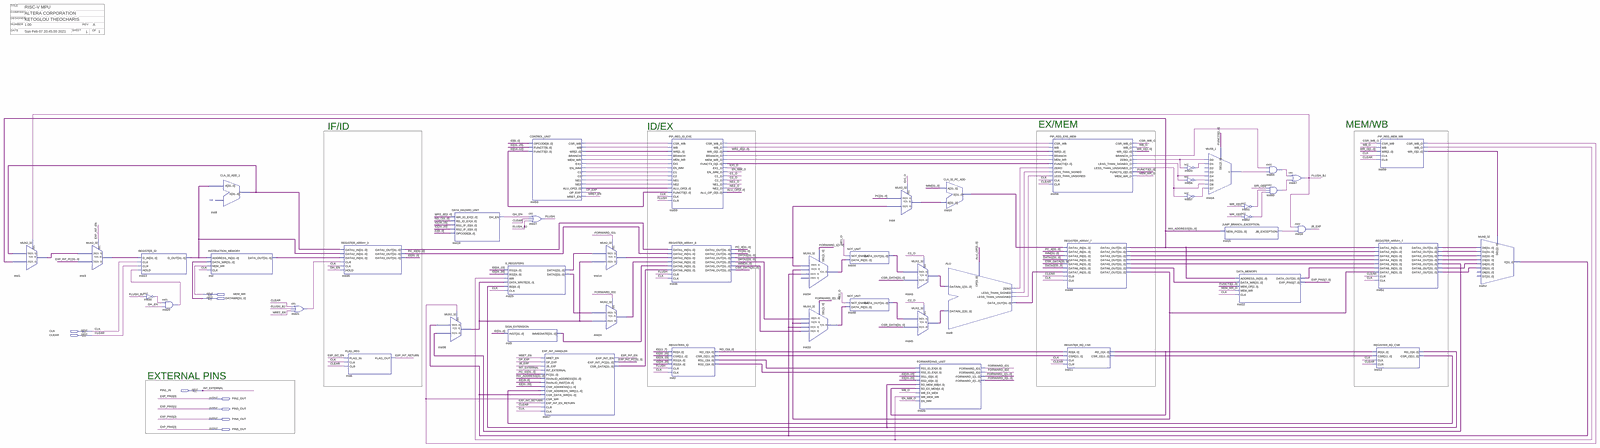
[diagram p0: schematic sheet, whole]
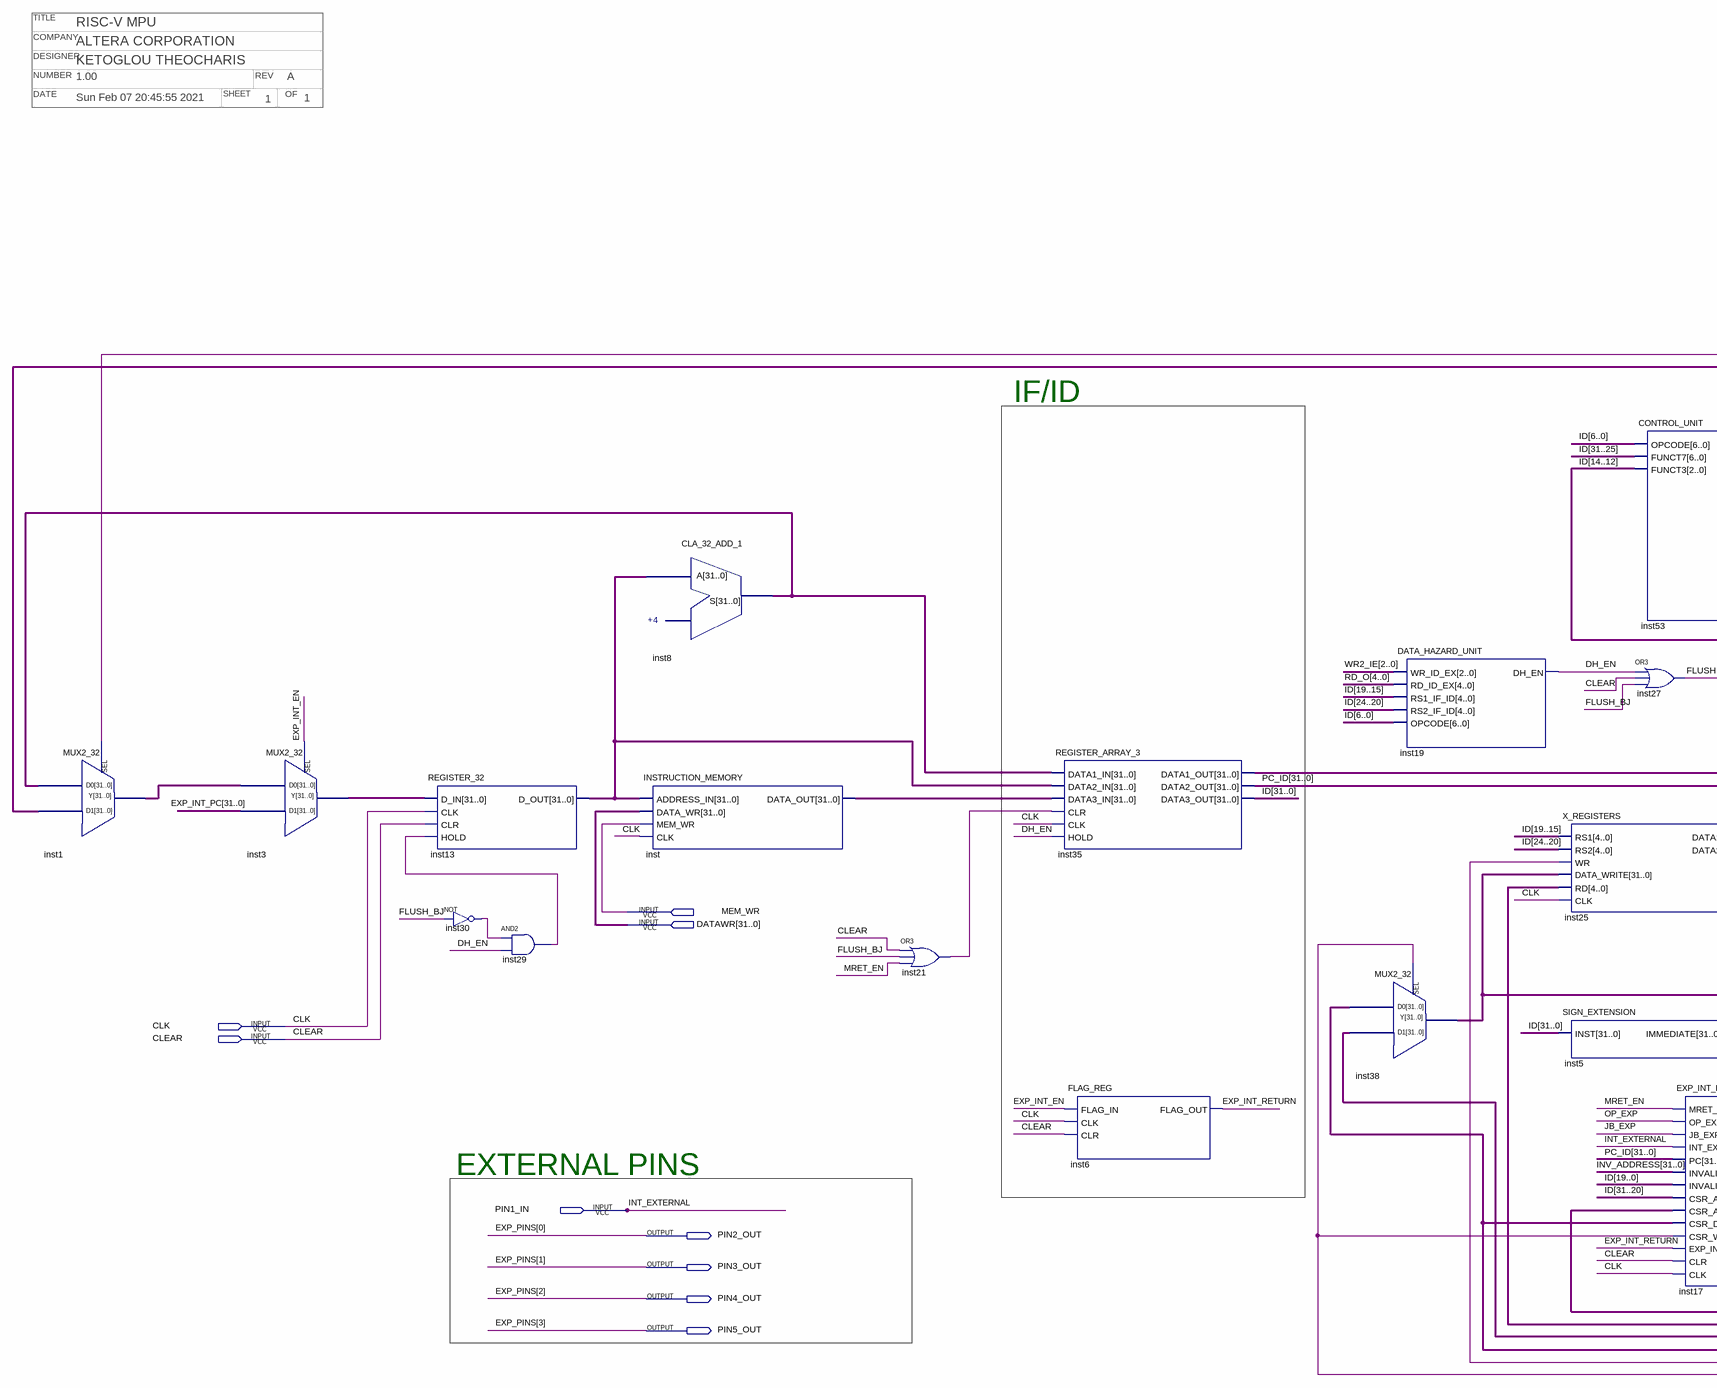
[diagram p1: schematic sheet, left part]
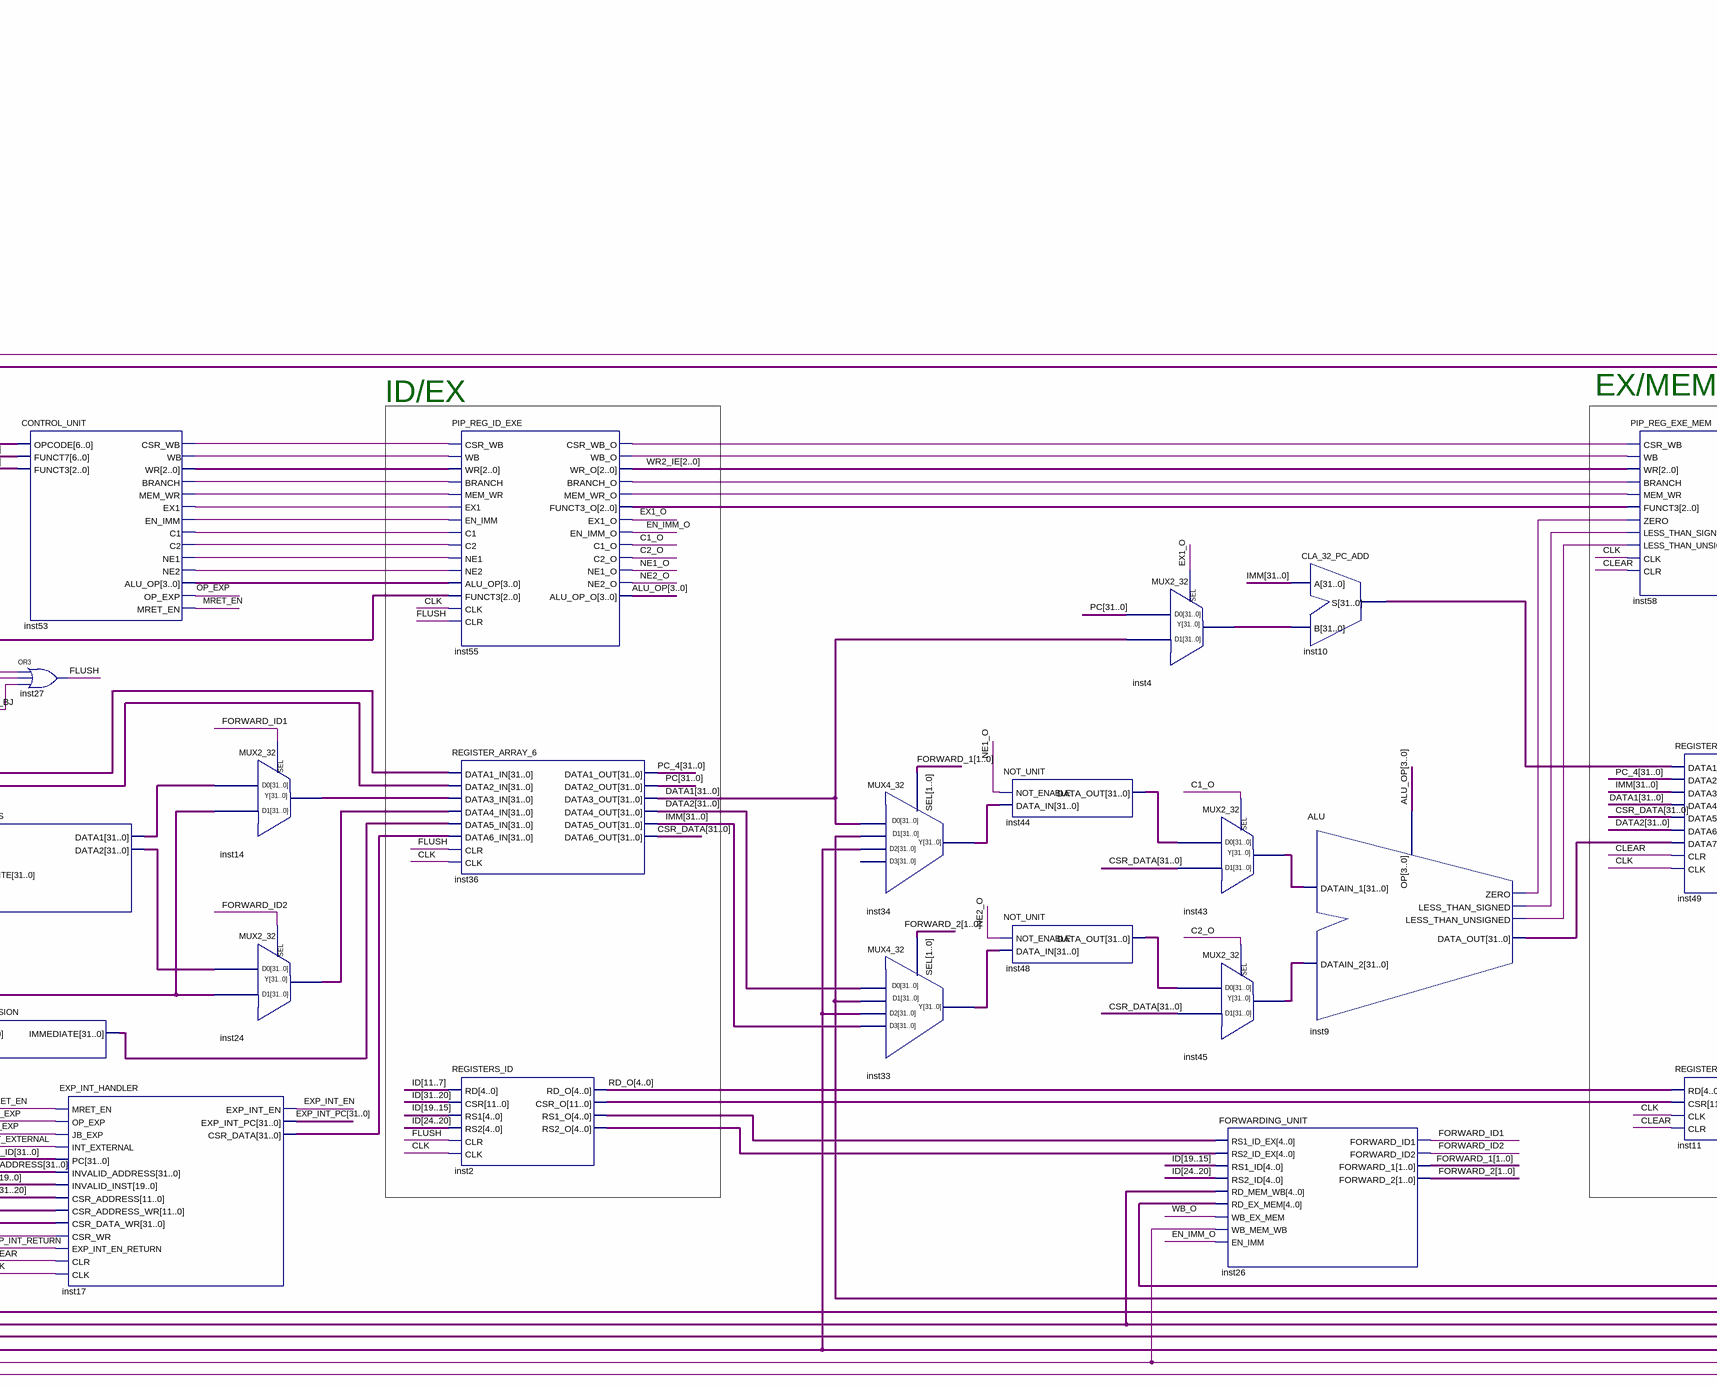
[diagram p2: schematic sheet, centre part]
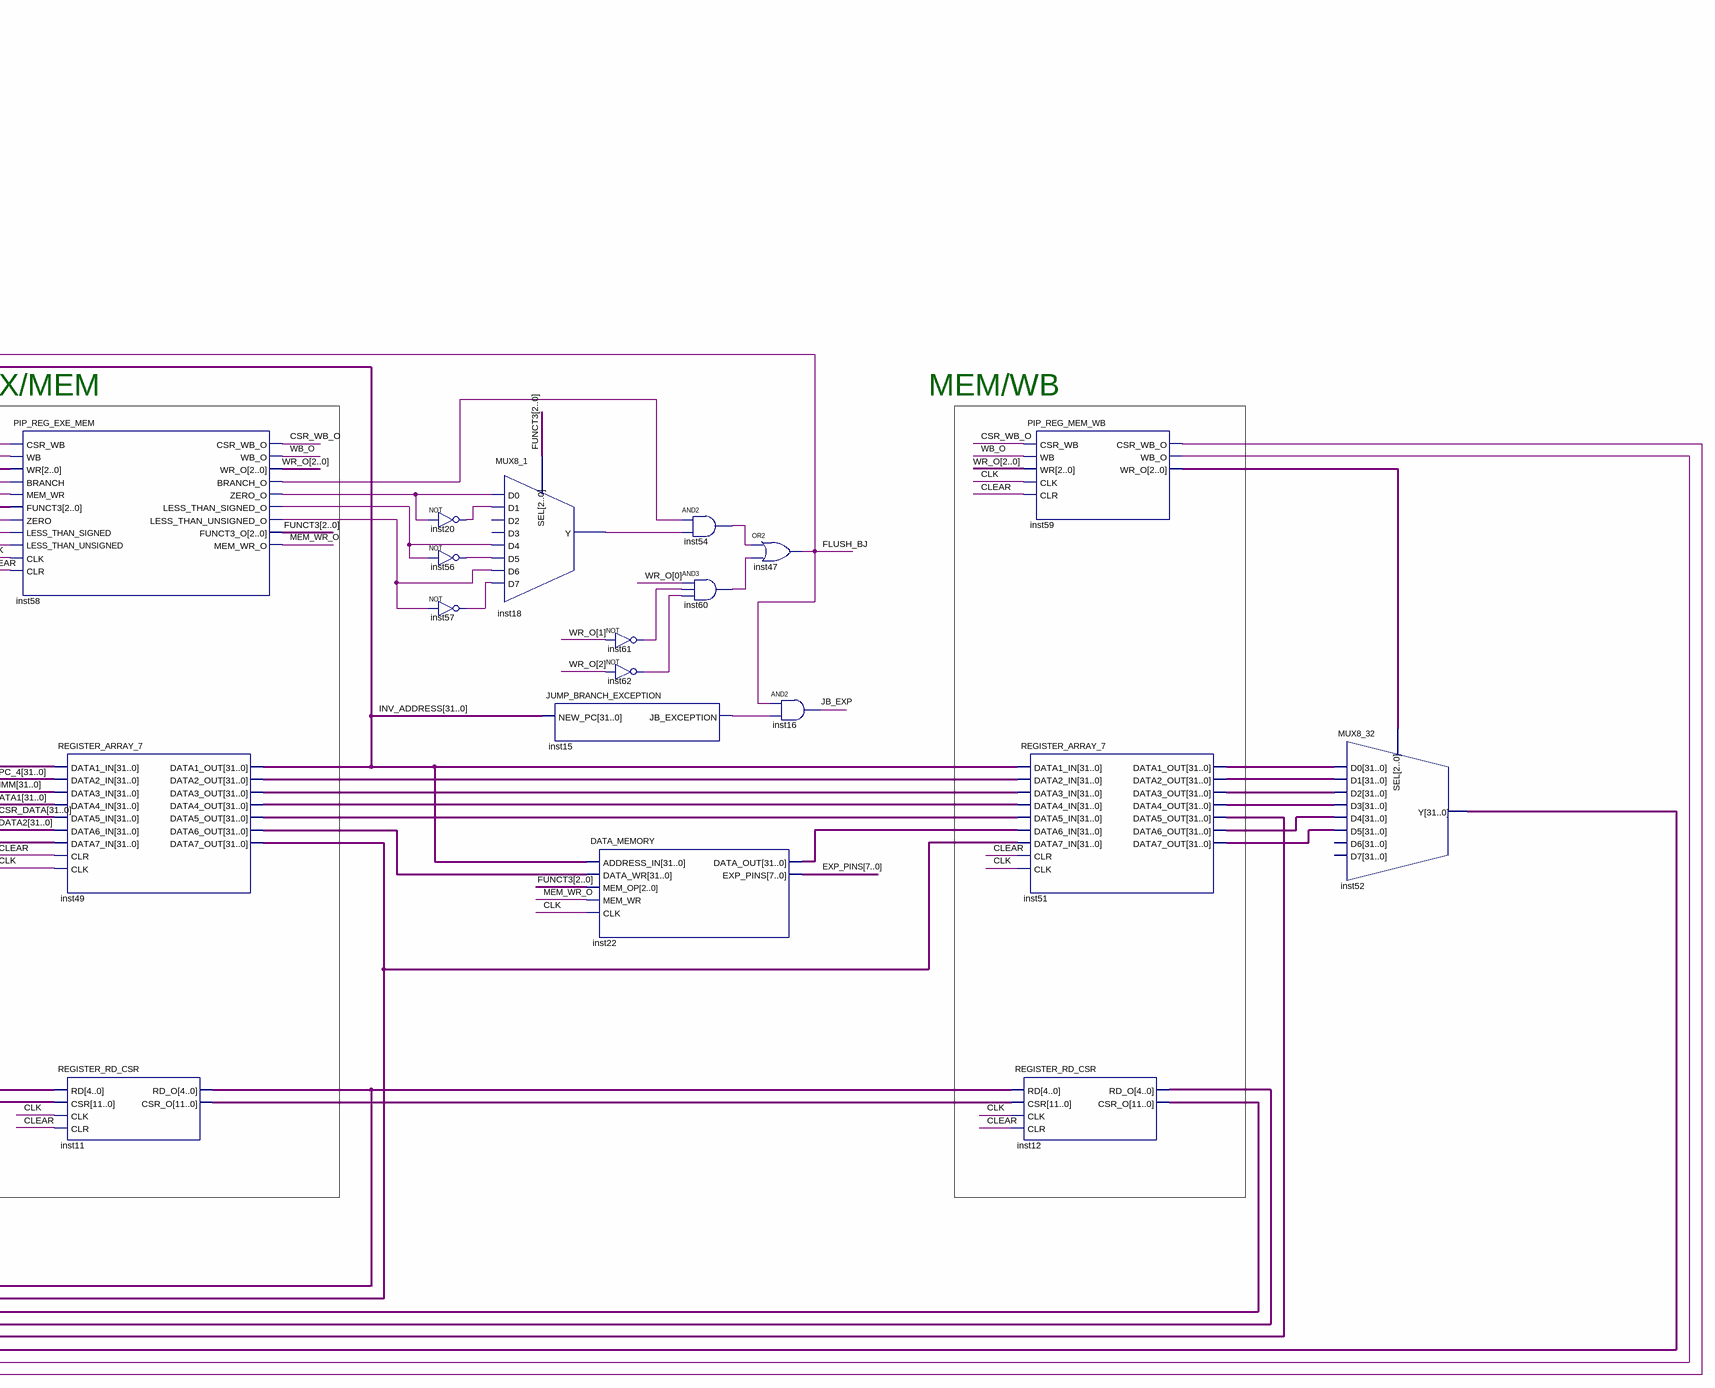
[diagram p3: schematic sheet, right part]
// Quartus schematic RISCV_CPU.bdf as structural Verilog: 51 symbols, 9 pins
// Title block: TITLE: RISC-V MPU; COMPANY: ALTERA CORPORATION; DESIGNER: KETOGLOU THEOCHARIS; NUMBER: 1.00; REV: A; DATE: Sun Feb 07 20:45:55 2021; SHEET: 1; OF: 1
module RISCV_CPU (
  input  MEM_WR,
  input  [31:0] DATAWR,
  input  CLK,
  input  CLEAR,
  input  PIN1_IN,
  output PIN2_OUT,
  output PIN3_OUT,
  output PIN4_OUT,
  output PIN5_OUT
);

  wire C1_O, C2_O, CSR_WB_O, DH_EN, EN_IMM_O, EX1_O, EXP_INT_EN, EXP_INT_RETURN, FLUSH, FLUSH_BJ,
       FORWARD_ID1, FORWARD_ID2, inst9_less_than_signed, inst9_less_than_unsigned, inst9_zero,
       inst15_jb_exception, inst18_y, inst20_out, inst21_out, inst29_out, inst30_out, inst53_branch,
       inst53_c1, inst53_c2, inst53_csr_wb, inst53_en_imm, inst53_ex1, inst53_mem_wr, inst53_ne1, inst53_ne2,
       inst53_wb, inst54_out, inst55_branch_o, inst55_csr_wb_o, inst55_mem_wr_o, inst55_wb_o, inst56_out,
       inst57_out, inst58_branch_o, inst58_less_than_signed_o, inst58_less_than_unsigned_o, inst58_zero_o,
       inst59_csr_wb_o, inst59_wb_o, inst60_out, inst61_out, inst62_out, JB_EXP, MEM_WR_O, MRET_EN, NE1_O,
       NE2_O, OP_EXP, WB_O;
  wire [1:0] FORWARD_1, FORWARD_2;
  wire [2:0] FUNCT3, inst53_wr, inst55_funct3_o, inst59_wr_o, WR2_IE, WR_O;
  wire [3:0] ALU_OP, inst53_alu_op;
  wire [4:0] inst2_rs1_o, inst2_rs2_o, inst11_rd_o, inst12_rd_o, RD_O;
  wire [7:4] EXP_PINS;
  wire [11:0] inst2_csr_o, inst11_csr_o, inst12_csr_o;
  wire [31:0] CSR_DATA, DATA1, DATA2, EXP_INT_PC, ID, IMM, inst1_y, inst3_y, inst4_y, inst5_immediate,
       inst8_s, inst9_data_out, inst10_s, inst13_d_out, inst14_y, inst17_csr_data, inst22_data_out, inst24_y,
       inst25_data1, inst25_data2, inst33_y, inst34_y, inst35_data1_out, inst38_y, inst43_y, inst44_data_out,
       inst45_y, inst48_data_out, inst49_data2_out, inst49_data3_out, inst49_data4_out, inst49_data5_out,
       inst49_data6_out, inst49_data7_out, inst51_data1_out, inst51_data2_out, inst51_data3_out,
       inst51_data4_out, inst51_data5_out, inst51_data6_out, inst51_data7_out, inst52_y, inst_data_out,
       INV_ADDRESS, PC, PC_4, PC_ID;

  MUX2_32 inst1 (.D1(INV_ADDRESS), .D0(inst8_s), .SEL(FLUSH_BJ), .Y(inst1_y));
  MUX2_32 inst3 (.D1(EXP_INT_PC), .D0(inst1_y), .SEL(EXP_INT_EN), .Y(inst3_y));
  REGISTER_32 inst13 (.D_IN(inst3_y), .CLK(CLK), .CLR(CLEAR), .HOLD(inst29_out), .D_OUT(inst13_d_out));
  not inst30 (inst30_out, FLUSH_BJ);
  and inst29 (inst29_out, inst30_out, DH_EN);
  CLA_32_ADD_1 inst8 (.A(inst13_d_out), .S(inst8_s));
  INSTRUCTION_MEMORY inst (
    .ADDRESS_IN(inst13_d_out), .DATA_WR(DATAWR), .MEM_WR(MEM_WR), .CLK(CLK), .DATA_OUT(inst_data_out));
  or inst21 (inst21_out, CLEAR, FLUSH_BJ, MRET_EN);
  REGISTER_ARRAY_3 inst35 (
    .DATA1_IN(inst8_s), .DATA2_IN(inst13_d_out), .DATA3_IN(inst_data_out), .CLR(inst21_out), .CLK(CLK),
    .HOLD(DH_EN), .DATA1_OUT(inst35_data1_out), .DATA2_OUT(PC_ID), .DATA3_OUT(ID));
  FLAG_REG inst6 (.FLAG_IN(EXP_INT_EN), .CLK(CLK), .CLR(CLEAR), .FLAG_OUT(EXP_INT_RETURN));
  DATA_HAZARD_UNIT inst19 (
    .WR_ID_EX(WR2_IE), .RD_ID_EX(RD_O), .RS1_IF_ID(ID[19:15]), .RS2_IF_ID(ID[24:20]), .OPCODE(ID[6:0]),
    .DH_EN(DH_EN));
  MUX2_32 inst38 (.D1(inst51_data5_out), .D0(inst52_y), .SEL(inst59_csr_wb_o), .Y(inst38_y));
  X_REGISTERS inst25 (
    .RS1(ID[19:15]), .RS2(ID[24:20]), .WR(inst59_wb_o), .DATA_WRITE(inst38_y), .RD(inst12_rd_o), .CLK(CLK),
    .DATA1(inst25_data1), .DATA2(inst25_data2));
  SIGN_EXTENSION inst5 (.INST(ID), .IMMEDIATE(inst5_immediate));
  CONTROL_UNIT inst53 (
    .OPCODE(ID[6:0]), .FUNCT7(ID[31:25]), .FUNCT3(ID[14:12]), .CSR_WB(inst53_csr_wb), .WB(inst53_wb),
    .WR(inst53_wr), .BRANCH(inst53_branch), .MEM_WR(inst53_mem_wr), .EX1(inst53_ex1), .EN_IMM(inst53_en_imm),
    .C1(inst53_c1), .C2(inst53_c2), .NE1(inst53_ne1), .NE2(inst53_ne2), .ALU_OP(inst53_alu_op),
    .OP_EXP(OP_EXP), .MRET_EN(MRET_EN));
  or inst27 (FLUSH, DH_EN, CLEAR, FLUSH_BJ);
  EXP_INT_HANDLER inst17 (
    .MRET_EN(MRET_EN), .OP_EXP(OP_EXP), .JB_EXP(JB_EXP), .INT_EXTERNAL(PIN1_IN), .PC(PC_ID),
    .INVALID_ADDRESS(INV_ADDRESS), .INVALID_INST(ID[19:0]), .CSR_ADDRESS(ID[31:20]),
    .CSR_ADDRESS_WR(inst12_csr_o), .CSR_DATA_WR(inst52_y), .CSR_WR(inst59_csr_wb_o),
    .EXP_INT_EN_RETURN(EXP_INT_RETURN), .CLR(CLEAR), .CLK(CLK), .EXP_INT_EN(EXP_INT_EN),
    .EXP_INT_PC(EXP_INT_PC), .CSR_DATA(inst17_csr_data));
  MUX2_32 inst14 (.D1(inst38_y), .D0(inst25_data1), .SEL(FORWARD_ID1), .Y(inst14_y));
  MUX2_32 inst24 (.D1(inst38_y), .D0(inst25_data2), .SEL(FORWARD_ID2), .Y(inst24_y));
  PIP_REG_ID_EXE inst55 (
    .CSR_WB(inst53_csr_wb), .WB(inst53_wb), .WR(inst53_wr), .BRANCH(inst53_branch), .MEM_WR(inst53_mem_wr),
    .EX1(inst53_ex1), .EN_IMM(inst53_en_imm), .C1(inst53_c1), .C2(inst53_c2), .NE1(inst53_ne1),
    .NE2(inst53_ne2), .ALU_OP(inst53_alu_op), .FUNCT3(ID[14:12]), .CLK(CLK), .CLR(FLUSH),
    .CSR_WB_O(inst55_csr_wb_o), .WB_O(inst55_wb_o), .WR_O(WR2_IE), .BRANCH_O(inst55_branch_o),
    .MEM_WR_O(inst55_mem_wr_o), .FUNCT3_O(inst55_funct3_o), .EX1_O(EX1_O), .EN_IMM_O(EN_IMM_O), .C1_O(C1_O),
    .C2_O(C2_O), .NE1_O(NE1_O), .NE2_O(NE2_O), .ALU_OP_O(ALU_OP));
  REGISTER_ARRAY_6 inst36 (
    .DATA1_IN(inst35_data1_out), .DATA2_IN(PC_ID), .DATA3_IN(inst14_y), .DATA4_IN(inst24_y),
    .DATA5_IN(inst5_immediate), .DATA6_IN(inst17_csr_data), .CLR(FLUSH), .CLK(CLK), .DATA1_OUT(PC_4),
    .DATA2_OUT(PC), .DATA3_OUT(DATA1), .DATA4_OUT(DATA2), .DATA5_OUT(IMM), .DATA6_OUT(CSR_DATA));
  REGISTERS_ID inst2 (
    .RD(ID[11:7]), .CSR(ID[31:20]), .RS1(ID[19:15]), .RS2(ID[24:20]), .CLR(FLUSH), .CLK(CLK), .RD_O(RD_O),
    .CSR_O(inst2_csr_o), .RS1_O(inst2_rs1_o), .RS2_O(inst2_rs2_o));
  MUX4_32 inst34 (.SEL(FORWARD_1), .D0(DATA1), .D2(inst52_y), .D1(inst49_data7_out), .Y(inst34_y));  // open: D3
  MUX4_32 inst33 (.SEL(FORWARD_2), .D0(DATA2), .D3(IMM), .D2(inst52_y), .D1(inst49_data7_out), .Y(inst33_y));
  NOT_UNIT inst44 (.NOT_ENABLE(NE1_O), .DATA_IN(inst34_y), .DATA_OUT(inst44_data_out));
  NOT_UNIT inst48 (.NOT_ENABLE(NE2_O), .DATA_IN(inst33_y), .DATA_OUT(inst48_data_out));
  MUX2_32 inst4 (.D1(DATA1), .D0(PC), .SEL(EX1_O), .Y(inst4_y));
  MUX2_32 inst43 (.D1(CSR_DATA), .D0(inst44_data_out), .SEL(C1_O), .Y(inst43_y));
  MUX2_32 inst45 (.D1(CSR_DATA), .D0(inst48_data_out), .SEL(C2_O), .Y(inst45_y));
  FORWARDING_UNIT inst26 (
    .RS1_ID_EX(inst2_rs1_o), .RS2_ID_EX(inst2_rs2_o), .RS1_ID(ID[19:15]), .RS2_ID(ID[24:20]),
    .RD_MEM_WB(inst12_rd_o), .RD_EX_MEM(inst11_rd_o), .WB_EX_MEM(WB_O), .WB_MEM_WB(inst59_wb_o),
    .EN_IMM(EN_IMM_O), .FORWARD_ID1(FORWARD_ID1), .FORWARD_ID2(FORWARD_ID2), .FORWARD_1(FORWARD_1),
    .FORWARD_2(FORWARD_2));
  CLA_32_PC_ADD inst10 (.A(IMM), .B(inst4_y), .S(inst10_s));
  ALU inst9 (
    .DATAIN_1(inst43_y), .DATAIN_2(inst45_y), .OP(ALU_OP), .DATA_OUT(inst9_data_out), .ZERO(inst9_zero),
    .LESS_THAN_SIGNED(inst9_less_than_signed), .LESS_THAN_UNSIGNED(inst9_less_than_unsigned));
  PIP_REG_EXE_MEM inst58 (
    .CSR_WB(inst55_csr_wb_o), .WB(inst55_wb_o), .WR(WR2_IE), .BRANCH(inst55_branch_o),
    .MEM_WR(inst55_mem_wr_o), .FUNCT3(inst55_funct3_o), .ZERO(inst9_zero),
    .LESS_THAN_SIGNED(inst9_less_than_signed), .LESS_THAN_UNSIGNED(inst9_less_than_unsigned), .CLK(CLK),
    .CLR(CLEAR), .CSR_WB_O(CSR_WB_O), .WB_O(WB_O), .WR_O(WR_O), .BRANCH_O(inst58_branch_o),
    .ZERO_O(inst58_zero_o), .LESS_THAN_SIGNED_O(inst58_less_than_signed_o),
    .LESS_THAN_UNSIGNED_O(inst58_less_than_unsigned_o), .FUNCT3_O(FUNCT3), .MEM_WR_O(MEM_WR_O));
  REGISTER_ARRAY_7 inst49 (
    .DATA1_IN(inst10_s), .DATA2_IN(PC_4), .DATA3_IN(IMM), .DATA4_IN(DATA1), .DATA5_IN(CSR_DATA),
    .DATA6_IN(DATA2), .DATA7_IN(inst9_data_out), .CLR(CLEAR), .CLK(CLK), .DATA1_OUT(INV_ADDRESS),
    .DATA2_OUT(inst49_data2_out), .DATA3_OUT(inst49_data3_out), .DATA4_OUT(inst49_data4_out),
    .DATA5_OUT(inst49_data5_out), .DATA6_OUT(inst49_data6_out), .DATA7_OUT(inst49_data7_out));
  REGISTER_RD_CSR inst11 (
    .RD(RD_O), .CSR(inst2_csr_o), .CLK(CLK), .CLR(CLEAR), .RD_O(inst11_rd_o), .CSR_O(inst11_csr_o));
  not inst20 (inst20_out, inst58_zero_o);
  not inst56 (inst56_out, inst58_less_than_signed_o);
  not inst57 (inst57_out, inst58_less_than_unsigned_o);
  MUX8_1 inst18 (
    .D0(inst58_zero_o), .D1(inst20_out), .D4(inst58_less_than_signed_o), .D5(inst56_out),
    .D6(inst58_less_than_unsigned_o), .D7(inst57_out), .SEL(FUNCT3), .Y(inst18_y));  // open: D2, D3
  JUMP_BRANCH_EXCEPTION inst15 (.NEW_PC(INV_ADDRESS), .JB_EXCEPTION(inst15_jb_exception));
  DATA_MEMORY inst22 (
    .ADDRESS_IN(INV_ADDRESS), .DATA_WR(inst49_data6_out), .MEM_OP(FUNCT3), .MEM_WR(MEM_WR_O), .CLK(CLK),
    .DATA_OUT(inst22_data_out), .EXP_PINS({EXP_PINS, PIN5_OUT, PIN4_OUT, PIN3_OUT, PIN2_OUT}));
  not inst61 (inst61_out, WR_O[1]);
  not inst62 (inst62_out, WR_O[2]);
  and inst54 (inst54_out, inst58_branch_o, inst18_y);
  and inst60 (inst60_out, WR_O[0], inst61_out, inst62_out);
  or inst47 (FLUSH_BJ, inst54_out, inst60_out);
  and inst16 (JB_EXP, FLUSH_BJ, inst15_jb_exception);
  PIP_REG_MEM_WB inst59 (
    .CSR_WB(CSR_WB_O), .WB(WB_O), .WR(WR_O), .CLK(CLK), .CLR(CLEAR), .CSR_WB_O(inst59_csr_wb_o),
    .WB_O(inst59_wb_o), .WR_O(inst59_wr_o));
  REGISTER_ARRAY_7 inst51 (
    .DATA1_IN(INV_ADDRESS), .DATA2_IN(inst49_data2_out), .DATA3_IN(inst49_data3_out),
    .DATA4_IN(inst49_data4_out), .DATA5_IN(inst49_data5_out), .DATA6_IN(inst22_data_out),
    .DATA7_IN(inst49_data7_out), .CLR(CLEAR), .CLK(CLK), .DATA1_OUT(inst51_data1_out),
    .DATA2_OUT(inst51_data2_out), .DATA3_OUT(inst51_data3_out), .DATA4_OUT(inst51_data4_out),
    .DATA5_OUT(inst51_data5_out), .DATA6_OUT(inst51_data6_out), .DATA7_OUT(inst51_data7_out));
  REGISTER_RD_CSR inst12 (
    .RD(inst11_rd_o), .CSR(inst11_csr_o), .CLK(CLK), .CLR(CLEAR), .RD_O(inst12_rd_o), .CSR_O(inst12_csr_o));
  MUX8_32 inst52 (
    .D0(inst51_data1_out), .D1(inst51_data2_out), .D2(inst51_data3_out), .D3(inst51_data4_out),
    .D4(inst51_data6_out), .D5(inst51_data7_out), .SEL(inst59_wr_o), .Y(inst52_y));  // open: D6, D7

  // Other names for the same wires on the sheet: EXP_PINS[3:0] = {PIN5_OUT, PIN4_OUT, PIN3_OUT, PIN2_OUT};
  //   INT_EXTERNAL = PIN1_IN

  // Notes on the sheet:
  //   EX/MEM
  //   MEM/WB
  //   IF/ID
  //   ID/EX
  //   EXTERNAL PINS
endmodule
